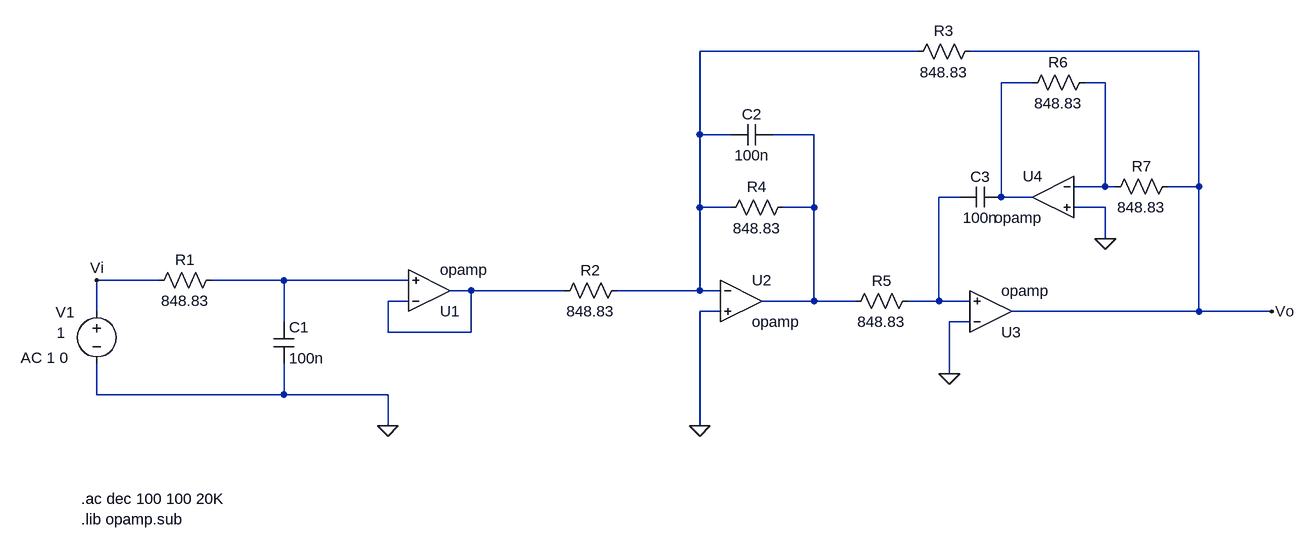
[diagram p0: schematic TS3_Bonus.asc]
TS3_Bonus.asc, the LTspice schematic file:
Version 4
SHEET 1 1824 680
WIRE 928 -240 592 -240
WIRE 1360 -240 1008 -240
WIRE 1104 -192 1056 -192
WIRE 1216 -192 1184 -192
WIRE 592 -112 592 -240
WIRE 640 -112 592 -112
WIRE 768 -112 704 -112
WIRE 1216 -32 1216 -192
WIRE 1216 -32 1168 -32
WIRE 1232 -32 1216 -32
WIRE 1360 -32 1360 -240
WIRE 1360 -32 1312 -32
WIRE 992 -16 960 -16
WIRE 1056 -16 1056 -192
WIRE 1104 -16 1056 -16
WIRE 592 0 592 -112
WIRE 640 0 592 0
WIRE 768 0 768 -112
WIRE 768 0 720 0
WIRE 1216 0 1168 0
WIRE 1216 48 1216 0
WIRE -240 112 -336 112
WIRE -48 112 -160 112
WIRE 144 112 -48 112
WIRE 240 128 208 128
WIRE 384 128 240 128
WIRE 592 128 592 0
WIRE 592 128 464 128
WIRE 624 128 592 128
WIRE 144 144 112 144
WIRE 768 144 768 0
WIRE 768 144 688 144
WIRE 832 144 768 144
WIRE 960 144 960 -16
WIRE 960 144 912 144
WIRE 1008 144 960 144
WIRE -336 160 -336 112
WIRE 624 160 592 160
WIRE 1360 160 1360 -32
WIRE 1360 160 1072 160
WIRE 1472 160 1360 160
WIRE -48 176 -48 112
WIRE 1008 176 976 176
WIRE 112 192 112 144
WIRE 240 192 240 128
WIRE 240 192 112 192
WIRE 976 256 976 176
WIRE -336 288 -336 240
WIRE -48 288 -48 240
WIRE -48 288 -336 288
WIRE 112 288 -48 288
WIRE 112 336 112 288
WIRE 592 336 592 160
FLAG 112 336 0
FLAG -336 112 Vi
FLAG 592 336 0
FLAG 976 256 0
FLAG 1216 48 0
FLAG 1472 160 Vo
SYMBOL cap -64 176 R0
SYMATTR InstName C1
SYMATTR Value 100n
SYMBOL res -144 96 R90
WINDOW 0 0 56 VBottom 2
WINDOW 3 32 56 VTop 2
SYMATTR InstName R1
SYMATTR Value 848.83
SYMBOL OpAmps\\opamp 176 192 M180
SYMATTR InstName U1
SYMBOL voltage -336 144 R0
WINDOW 3 -62 49 Left 2
WINDOW 123 -117 87 Left 2
WINDOW 39 0 0 Left 0
WINDOW 0 -63 17 Left 2
SYMATTR Value 1
SYMATTR Value2 AC 1 0
SYMATTR InstName V1
SYMBOL OpAmps\\opamp 656 80 R0
SYMATTR InstName U2
SYMBOL OpAmps\\opamp 1040 224 M180
SYMATTR InstName U3
SYMBOL OpAmps\\opamp 1136 -80 M0
SYMATTR InstName U4
SYMBOL res 480 112 R90
WINDOW 0 0 56 VBottom 2
WINDOW 3 32 56 VTop 2
SYMATTR InstName R2
SYMATTR Value 848.83
SYMBOL res 1024 -256 R90
WINDOW 0 0 56 VBottom 2
WINDOW 3 32 56 VTop 2
SYMATTR InstName R3
SYMATTR Value 848.83
SYMBOL res 736 -16 R90
WINDOW 0 0 56 VBottom 2
WINDOW 3 32 56 VTop 2
SYMATTR InstName R4
SYMATTR Value 848.83
SYMBOL res 928 128 R90
WINDOW 0 0 56 VBottom 2
WINDOW 3 32 56 VTop 2
SYMATTR InstName R5
SYMATTR Value 848.83
SYMBOL res 1200 -208 R90
WINDOW 0 0 56 VBottom 2
WINDOW 3 32 56 VTop 2
SYMATTR InstName R6
SYMATTR Value 848.83
SYMBOL res 1328 -48 R90
WINDOW 0 0 56 VBottom 2
WINDOW 3 32 56 VTop 2
SYMATTR InstName R7
SYMATTR Value 848.83
SYMBOL cap 704 -128 R90
WINDOW 0 0 32 VBottom 2
WINDOW 3 32 32 VTop 2
SYMATTR InstName C2
SYMATTR Value 100n
SYMBOL cap 1056 -32 R90
WINDOW 0 0 32 VBottom 2
WINDOW 3 32 32 VTop 2
SYMATTR InstName C3
SYMATTR Value 100n
TEXT -360 480 Left 2 !.lib opamp.sub
TEXT -360 448 Left 2 !.ac dec 100 100 20K

The netlist it stands for:
* TS3_Bonus.asc
C1 N006 0 100n
R1 N006 Vi 848.83
XU1 N007 N006 N007 opamp Aol=100K GBW=10Meg  ; pins invin noninvin out
V1 Vi 0 1 AC 1 0
XU2 N001 0 N004 opamp Aol=100K GBW=10Meg  ; pins invin noninvin out
XU3 0 N005 Vo opamp Aol=100K GBW=10Meg  ; pins invin noninvin out
XU4 N003 0 N002 opamp Aol=100K GBW=10Meg  ; pins invin noninvin out
R2 N001 N007 848.83
R3 Vo N001 848.83
R4 N004 N001 848.83
R5 N005 N004 848.83
R6 N003 N002 848.83
R7 Vo N003 848.83
C2 N004 N001 100n
C3 N002 N005 100n
.lib opamp.sub
.ac dec 100 100 20K
.backanno
.end